# EAGLE design CS_EPS (EAGLE 9.5.0)
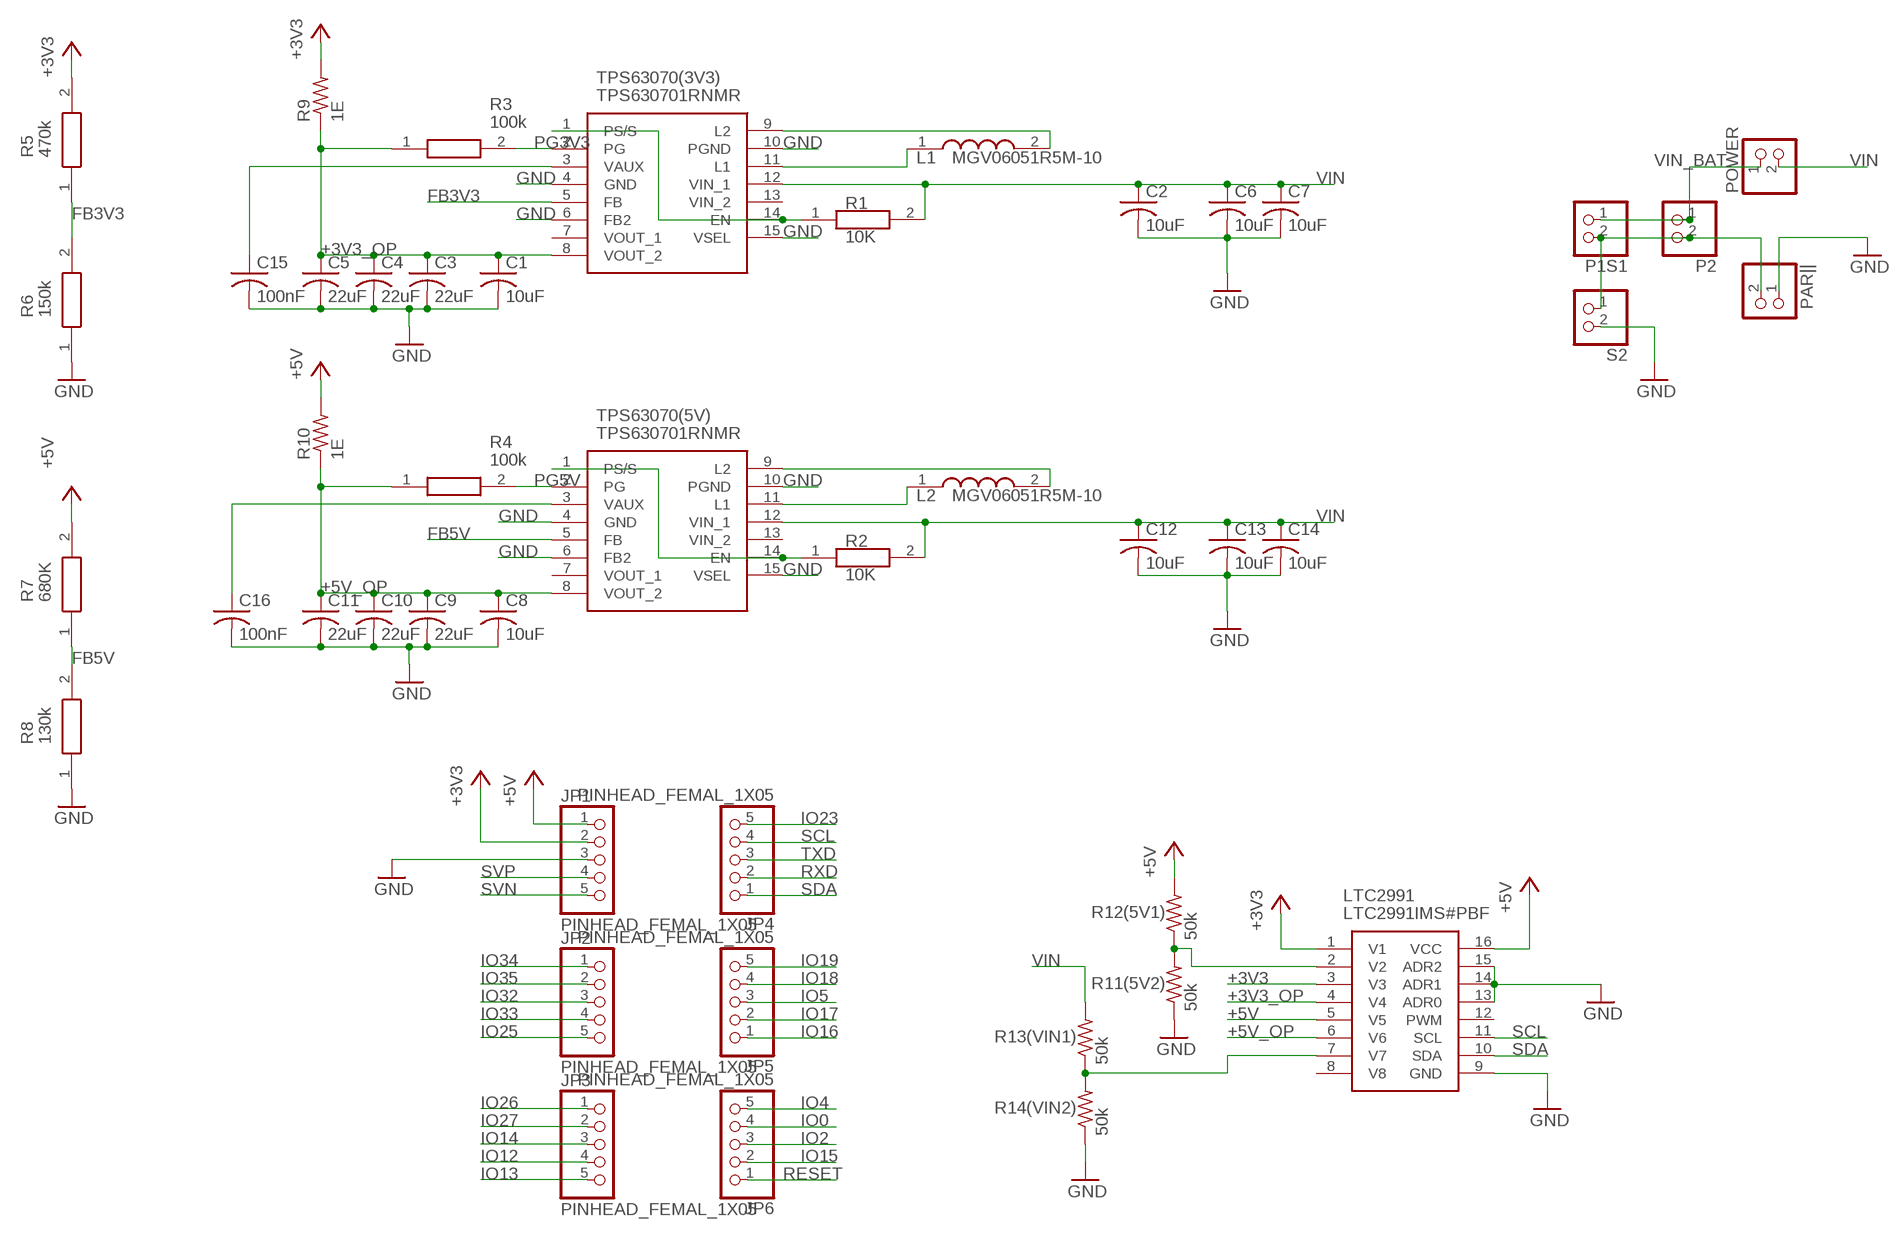
[diagram p0: schematic, sheet 1]

## Parts
C1  10uF  C-USC0603K  [C0603K]
C2  10uF  C-USC0603K  [C0603K]
C3  22uF  C-USC0805K  [C0805K]
C4  22uF  C-USC0805K  [C0805K]
C5  22uF  C-USC0805K  [C0805K]
C6  10uF  C-USC0805K  [C0805K]
C7  10uF  C-USC0805K  [C0805K]
C8  10uF  C-USC0603K  [C0603K]
C9  22uF  C-USC0805K  [C0805K]
C10  22uF  C-USC0805K  [C0805K]
C11  22uF  C-USC0805K  [C0805K]
C12  10uF  C-USC0603K  [C0603K]
C13  10uF  C-USC0805K  [C0805K]
C14  10uF  C-USC0805K  [C0805K]
C15  100nF  C-USC0402  [C0402]
C16  100nF  C-USC0402  [C0402]
JP1  PINHEAD_FEMAL_1X05  [1X05F]
JP2  PINHEAD_FEMAL_1X05  [1X05F]
JP3  PINHEAD_FEMAL_1X05  [1X05F]
JP4  PINHEAD_FEMAL_1X05  [1X05F]
JP5  PINHEAD_FEMAL_1X05  [1X05F]
JP6  PINHEAD_FEMAL_1X05  [1X05F]
L1  MGV06051R5M-10  [INDPM7367X530N]
L2  MGV06051R5M-10  [INDPM7367X530N]
LTC2991  LTC2991IMS#PBF  [SOP50P490X110-16N]
P1S1  JST_2PIN-THM  [JST-PH-2-THM]
P2  JST_2PIN-THM  [JST-PH-2-THM]
PAR||  PINHD-1X2  [1X02]
POWER  PINHD-1X2  [1X02]
R1  10K  ERA-6AED134V  [RESC2012X60N]
R2  10K  ERA-6AED134V  [RESC2012X60N]
R3  100k  ERA-6AED134V  [RESC2012X60N]
R4  100k  ERA-6AED134V  [RESC2012X60N]
R5  470k  ERA-6AED134V  [RESC2012X60N]
R6  150k  ERA-6AED134V  [RESC2012X60N]
R7  680K  ERA-6AED134V  [RESC2012X60N]
R8  130k  ERA-6AED134V  [RESC2012X60N]
R9  1E  R-US_R0805  [R0805]
R10  1E  R-US_R0805  [R0805]
R11(5V2)  50k  R-US_R0805  [R0805]
R12(5V1)  50k  R-US_R0805  [R0805]
R13(VIN1)  50k  R-US_R0805  [R0805]
R14(VIN2)  50k  R-US_R0805  [R0805]
S2  JST_2PIN-THM  [JST-PH-2-THM]
TPS63070(3V3)  TPS630701RNMR  [TPS630701RNMR]
TPS63070(5V)  TPS630701RNMR  [TPS630701RNMR]

## Nets
+3V3: JP1.2 LTC2991.1(V1) LTC2991.3(V3) R5.2 R9.2
+3V3_OP: C1.1 C3.1 C4.1 C5.1 LTC2991.4(V4) R3.1 R9.1 TPS63070(3V3).8(VOUT_2)
+5V: JP1.1 LTC2991.5(V5) LTC2991.16(VCC) R7.2 R10.2 R12(5V1).2
+5V_OP: C8.1 C9.1 C10.1 C11.1 LTC2991.6(V6) R4.1 R10.1 TPS63070(5V).8(VOUT_2)
FB3V3: R5.1 R6.2 TPS63070(3V3).5(FB)
FB5V: R7.1 R8.2 TPS63070(5V).5(FB)
GND: C1.2 C2.2 C3.2 C4.2 C5.2 C6.2 C7.2 C8.2 C9.2 C10.2 C11.2 C12.2 C13.2 C14.2 C15.2 C16.2 JP1.3 LTC2991.9(GND) LTC2991.13(ADR0) LTC2991.14(ADR1) LTC2991.15(ADR2) PAR||.1 R6.1 R8.1 R11(5V2).1 R14(VIN2).1 S2.2 TPS63070(3V3).4(GND) TPS63070(3V3).6(FB2) TPS63070(3V3).10(PGND) TPS63070(3V3).15(VSEL) TPS63070(5V).4(GND) TPS63070(5V).6(FB2) TPS63070(5V).10(PGND) TPS63070(5V).15(VSEL)
IO0: JP6.4
IO2: JP6.3
IO4: JP6.5
IO5: JP5.3
IO12: JP3.4
IO13: JP3.5
IO14: JP3.3
IO15: JP6.2
IO16: JP5.1
IO17: JP5.2
IO18: JP5.4
IO19: JP5.5
IO23: JP4.5
IO25: JP2.5
IO26: JP3.1
IO27: JP3.2
IO32: JP2.3
IO33: JP2.4
IO34: JP2.1
IO35: JP2.2
L11: L1.1 TPS63070(3V3).11(L1)
L12: L1.2 TPS63070(3V3).9(L2)
L21: L2.1 TPS63070(5V).11(L1)
L22: L2.2 TPS63070(5V).9(L2)
N$1: P1S1.2 P2.2 PAR||.2 S2.1
N$2: LTC2991.2(V2) R11(5V2).2 R12(5V1).1
N$3: R1.1 TPS63070(3V3).1(PS/S) TPS63070(3V3).14(EN)
N$4: LTC2991.7(V7) R13(VIN1).1 R14(VIN2).2
N$6: R2.1 TPS63070(5V).1(PS/S) TPS63070(5V).14(EN)
N$7: C15.1 TPS63070(3V3).3(VAUX)
N$8: C16.1 TPS63070(5V).3(VAUX)
PG3V3: R3.2 TPS63070(3V3).2(PG)
PG5V: R4.2 TPS63070(5V).2(PG)
RESET: JP6.1
RXD: JP4.2
SCL: JP4.4 LTC2991.11(SCL)
SDA: JP4.1 LTC2991.10(SDA)
SVN: JP1.5
SVP: JP1.4
TXD: JP4.3
VIN: C2.1 C6.1 C7.1 C12.1 C13.1 C14.1 POWER.2 R1.2 R2.2 R13(VIN1).2 TPS63070(3V3).12(VIN_1) TPS63070(5V).12(VIN_1)
VIN_BAT: P1S1.1 P2.1 POWER.1
Unconnected: LTC2991.8(V8) LTC2991.12(PWM) TPS63070(3V3).7(VOUT_1) TPS63070(3V3).13(VIN_2) TPS63070(5V).7(VOUT_1) TPS63070(5V).13(VIN_2)

## Library data of the parts
C1-C16 = rcl:C-US: CAPACITOR, American symbol; SPICEPREFIX: C
JP1-JP6 = SamacSys_3D:PINHEAD_FEMAL_1X05
L1 L2 = SamacSys_3D:MGV06051R5M-10: Fixed Inductors 1.5uH +/-20% Source: Datasheet <https://assets.lairdtech.com/home/brandworld/files/MGV06051R5M-10.pdf>; DESCRIPTION: Fixed Inductors 1.5uH +/-20%; HEIGHT: 5.3mm; MANUFACTURER_NAME: Laird Performance Materials; MANUFACTURER_PART_NUMBER: MGV06051R5M-10; MOUSER_PART_NUMBER: 875-MGV06051R5M-10; MOUSER_PRICE-STOCK: https://www.mouser.com/Search/Refine.aspx?Keyword=875-MGV06051R5M-10
LTC2991 = SamacSys_3D:LTC2991IMS#PBF: Current & Power Monitors & Regulators Octal I2C V, C, & Temp Mon Source: Datasheet <https://www.analog.com/media/en/technical-documentation/data-sheets/2991ff.pdf>; DESCRIPTION: Current & Power Monitors & Regulators Octal I2C V, C, & Temp Mon; HEIGHT: 1.1mm; MANUFACTURER_NAME: Analog Devices; MANUFACTURER_PART_NUMBER: LTC2991IMS#PBF; MOUSER_PART_NUMBER: 584-LTC2991IMS#PBF; MOUSER_PRICE-STOCK: https://www.mouser.com/Search/Refine.aspx?Keyword=584-LTC2991IMS%23PBF
P1S1 P2 S2 = adafruit:JST_2PIN: JST 2-Pin Connectors of various flavors SMT-RA (S2B-PH-SM4) 4UConnector #17311 SMT (B2B-PH-SM4) THM-RA (S2B-PH) THM (B2B-PH)
PAR|| POWER = pinhead:PINHD-1X2: PIN HEADER
R1-R8 = SamacSys_Parts:ERA-6AED134V: PANASONIC ELECTRONIC COMPONENTS - ERA-6AED134V - RES, THIN FILM, 130K, 0.5%, 0.125W, 0805 Source: Datasheet <https://industrial.panasonic.com/cdbs/www-data/pdf/RDA0000/AOA0000C237.pdf>; DESCRIPTION: PANASONIC ELECTRONIC COMPONENTS - ERA-6AED134V - RES, THIN FILM, 130K, 0.5%, 0.125W, 0805; HEIGHT: 0.6mm; MANUFACTURER_NAME: Panasonic; MANUFACTURER_PART_NUMBER: ERA-6AED134V; MOUSER_PART_NUMBER: 667-ERA-6AED134V; MOUSER_PRICE-STOCK: https://www.mouser.com/Search/Refine.aspx?Keyword=667-ERA-6AED134V
R9 R10 R11(5V2) R12(5V1) R13(VIN1) R14(VIN2) = rcl:R-US_: RESISTOR, American symbol; SPICEPREFIX: R
TPS63070(3V3) TPS63070(5V) = SamacSys_3D:TPS630701RNMR: Wide Input Voltage (2V-16V) Buck-Boost Converter Source: Datasheet <http://www.ti.com/lit/gpn/tps63070>; DESCRIPTION: Wide Input Voltage (2V-16V) Buck-Boost Converter; HEIGHT: mm; MANUFACTURER_NAME: Texas Instruments; MANUFACTURER_PART_NUMBER: TPS630701RNMR; MOUSER_PART_NUMBER: 595-TPS630701RNMR; MOUSER_PRICE-STOCK: https://www.mouser.com/Search/Refine.aspx?Keyword=595-TPS630701RNMR

## Board
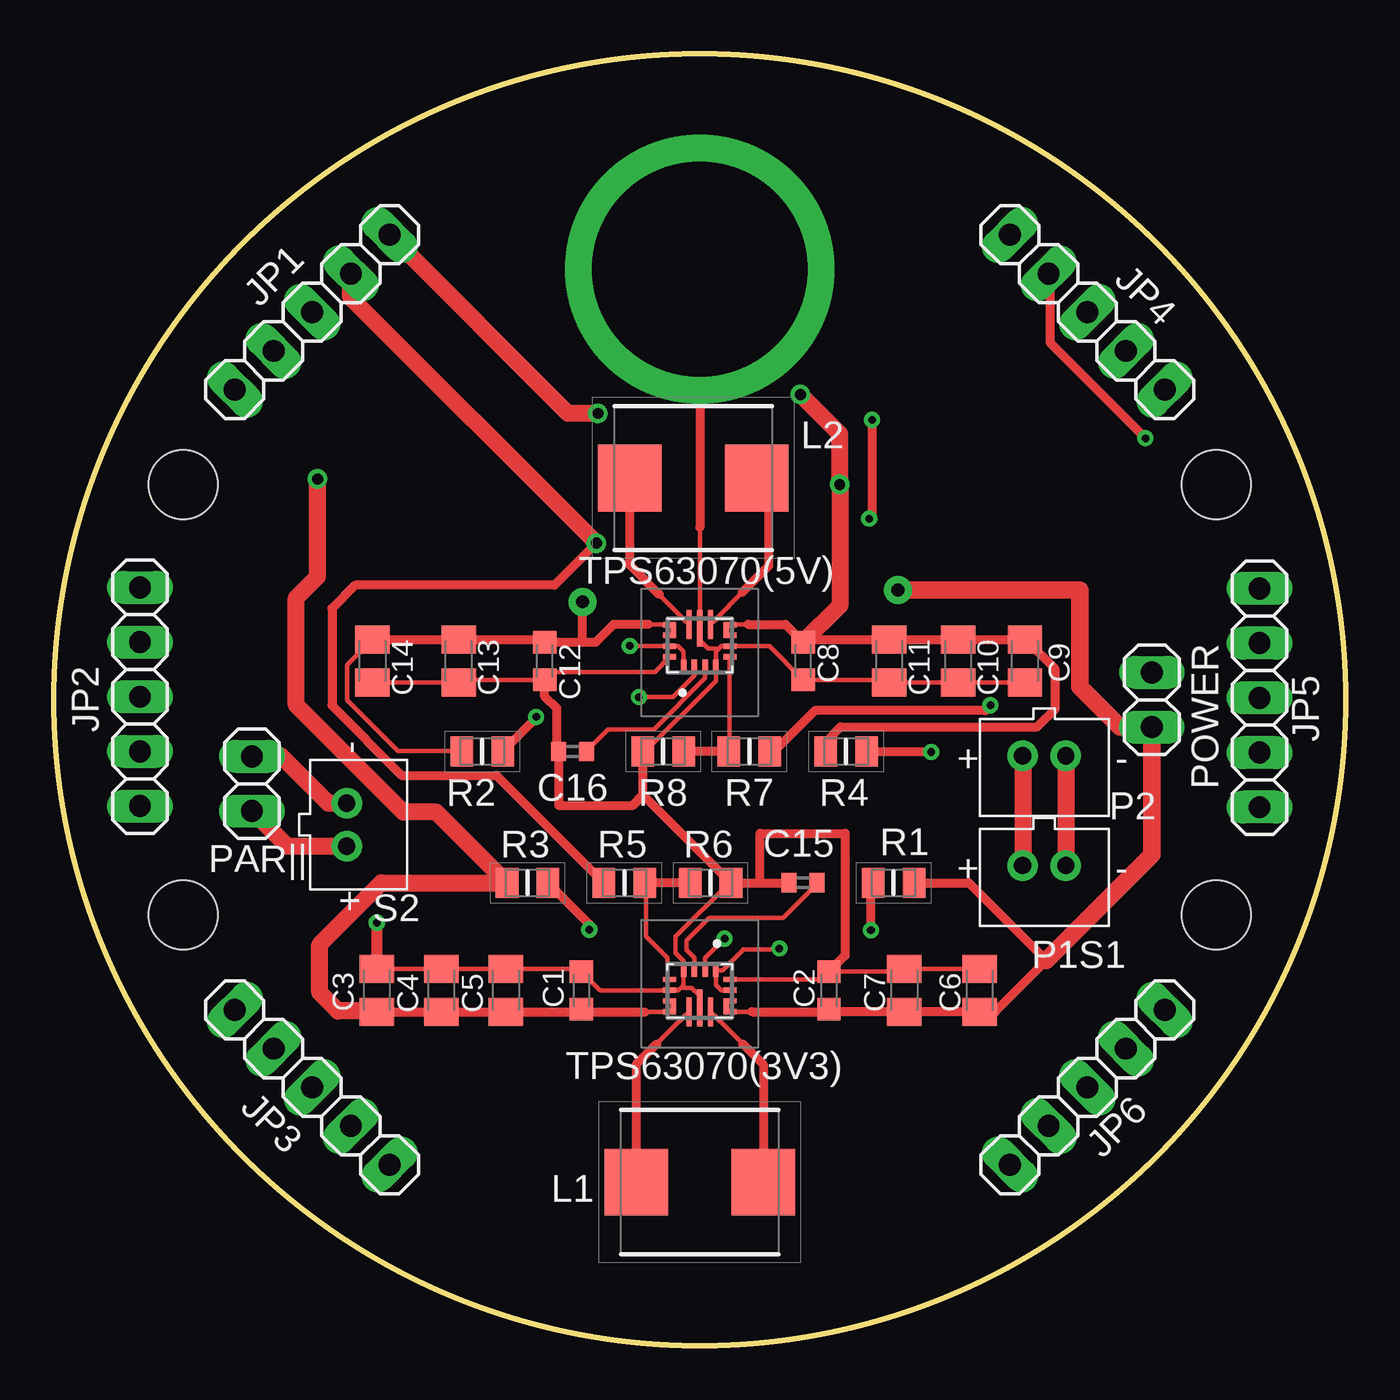
[diagram p1: board, top side]
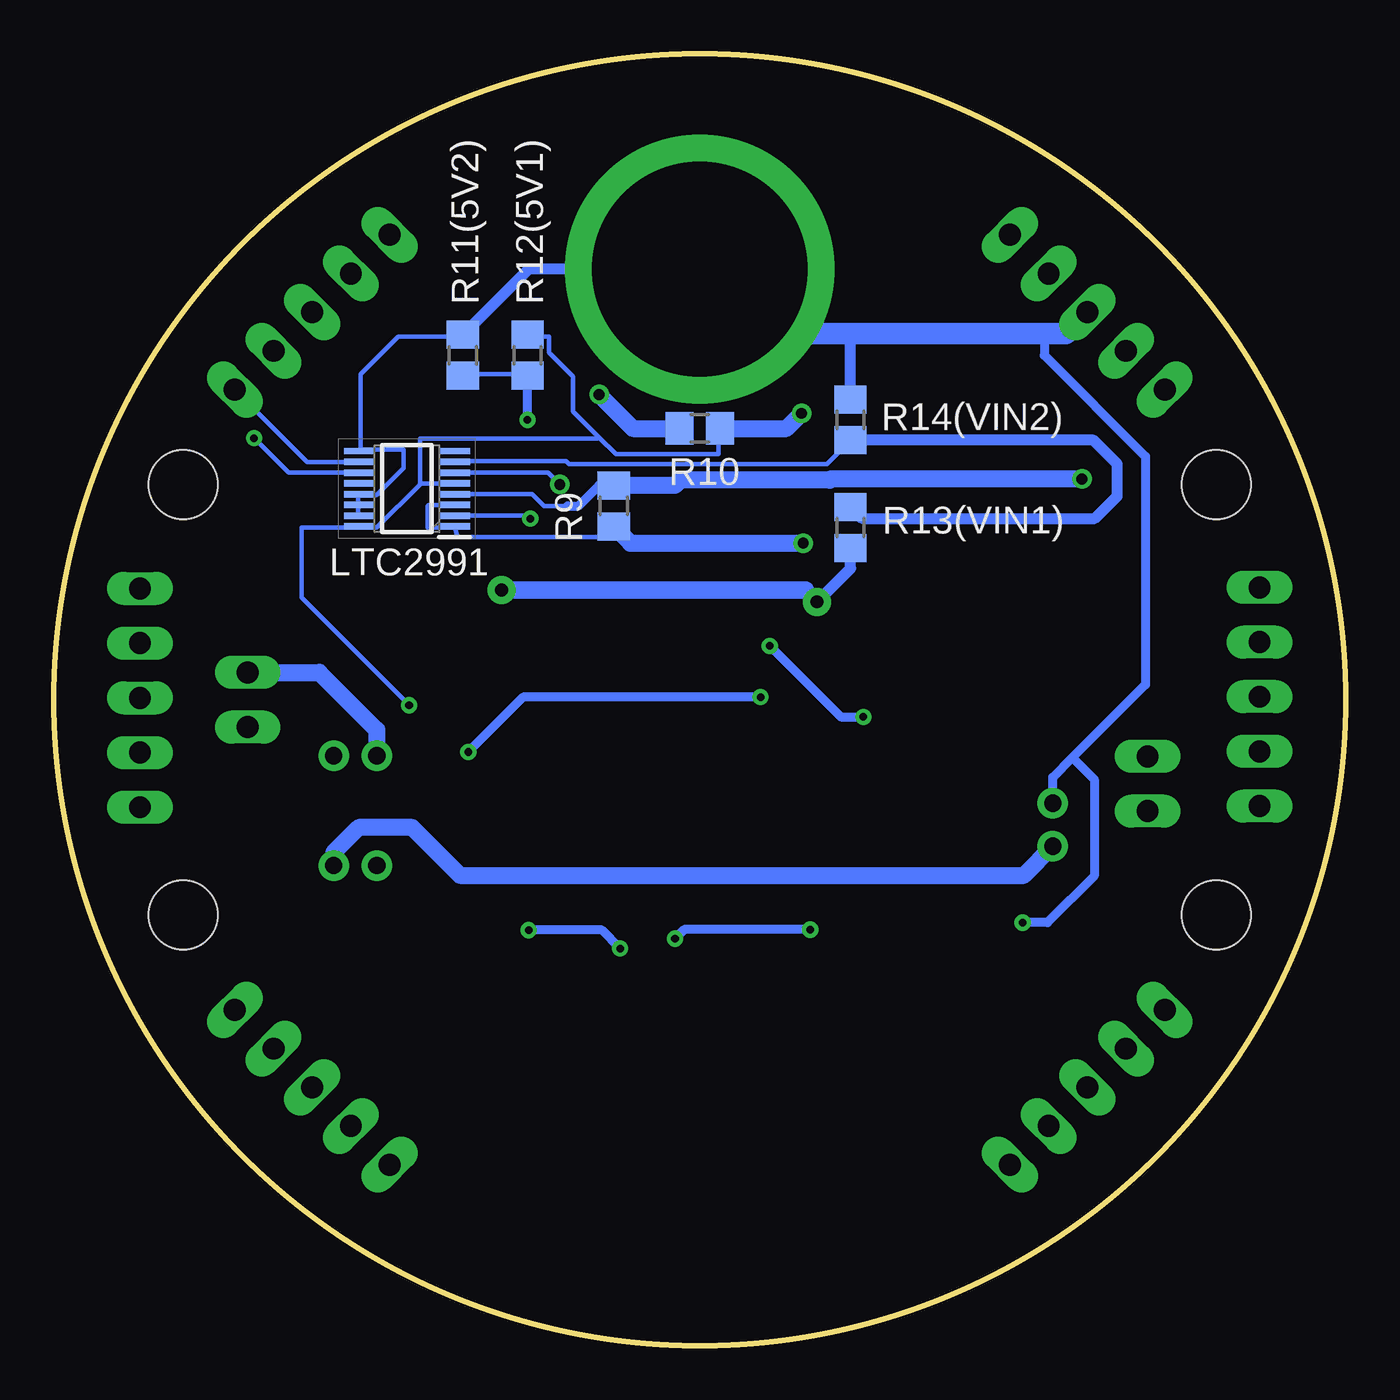
[diagram p2: board, bottom side, seen from below]

Size 60 x 60 mm. Coordinates in mm from the lower left corner, seen from the top.
Outline: circle at 30,30 radius 30
Copper layers (1*16): Top 0.035mm / dielectric 1.5mm / Bottom 0.035mm
Design rules "CanSat *": minimum track width 8mil, minimum drill 0.35mm, track to track 8mil, track to pad 8mil, pad to pad 6mil, via to via 15mil, smd to smd 6mil, copper to edge 1.5mm, drill to drill 10mil, minimum pad ring 10mil, minimum via ring 8mil, stop-mask expansion 6mil, vias tented up to drill 0mil, thermal gap 8mil
Holes 3.2 mm at 6,40 6,20 54,40 54,20
vRestrict: area 22,44 to 38,54

### Footprints (pad centres in the part's own frame; a part is rotated, then mirrored left to right if it is on the bottom)
C0603K = smd 1.05 x 1.08: 1 -0.875,0; 2 0.875,0
C0805K = smd 1.3 x 1.6: 1 -1,0; 2 1,0
C0402 = smd 0.7 x 0.9: 1 -0.65,0; 2 0.65,0
1X05F = drill 1.016 long: 1 -5.08,0; 2 -2.54,0; 3 0,0; 4 2.54,0; 5 5.08,0
INDPM7367X530N = smd 2.95 x 3.1: 1 -2.95,0; 2 2.95,0
SOP50P490X110-16N = smd 1.425 x 0.3: 1 -2.212,1.75; 2 -2.212,1.25; 3 -2.212,0.75; 4 -2.212,0.25; 5 -2.212,-0.25; 6 -2.212,-0.75; 7 -2.212,-1.25; 8 -2.212,-1.75; 9 2.212,-1.75; 10 2.212,-1.25; 11 2.212,-0.75; 12 2.212,-0.25; 13 2.212,0.25; 14 2.212,0.75; 15 2.212,1.25; 16 2.212,1.75
JST-PH-2-THM = drill 0.8 pad 1.422: 1 1,0; 2 -1,0
1X02 = drill 1.016 long: 1 -1.27,0; 2 1.27,0
RESC2012X60N = smd 1.05 x 1.4: 1 -0.95,0; 2 0.95,0
R0805 = smd 1.3 x 1.5: 1 -0.95,0; 2 0.95,0
TPS630701RNMR = smd 0.6 x 0.25: 1 -0.438,0.75; 2 -0.438,0.25; 3 -0.438,-0.25; 4 -0.438,-0.75 | smd 0.25 x 0.6: 5 -0.012,-1.4; 6 0.488,-1.4; 7 0.988,-1.4; 8 1.488,-1.4; 12 1.488,1.4; 13 0.988,1.4; 14 0.488,1.4; 15 -0.012,1.4 | smd 1.35 x 0.25: 9 1.488,-0.5; 11 1.488,0.5 | smd 1.7 x 0.25: 10 1.313,0 | smd 0.25 x 0.25: 16 1.238,1.225; 17 1.238,-1.225

### Placement (x,y rotation side)
C1  24.5,16.5 90 top
C2  36,16.5 90 top
C3  15,16.5 90 top
C4  18,16.5 90 top
C5  21,16.5 90 top
C6  43,16.5 90 top
C7  39.5,16.5 90 top
C8  34.8,31.8 270 top
C9  45.1,31.8 270 top
C10  42,31.8 270 top
C11  38.8,31.8 270 top
C12  22.8,31.8 270 top
C13  18.8,31.8 270 top
C14  14.8,31.8 270 top
C15  34.8,21.5 180 top
C16  24.1,27.6 180 top
JP1  12,48 225 top
JP2  4,30.14 270 top
JP3  12,12 315 top
JP4  48,48 135 top
JP5  56,30.09 90 top
JP6  48,12 45 top
L1  30,7.6 180 top
L2  29.7,40.3 0 top
LTC2991  43.6,39.8 180 bottom
P1S1  46,22.3 180 top
P2  46,27.4 180 top
PAR||  9.2,26.1 270 top
POWER  51,30 270 top
R1  39,21.5 0 top
R2  19.9,27.6 180 top
R3  22,21.5 0 top
R4  36.8,27.6 0 top
R5  26.5,21.5 180 top
R6  30.5,21.5 180 top
R7  32.3,27.6 0 top
R8  28.3,27.6 0 top
R9  34,39 270 bottom
R10  30,42.6 0 bottom
R11(5V2)  41,46 270 bottom
R12(5V1)  38,46 90 bottom
R13(VIN1)  23,38 270 bottom
R14(VIN2)  23,43 270 bottom
S2  13.61,24.2 270 top
TPS63070(3V3)  30,17 270 top
TPS63070(5V)  30,32 90 top

### Tracks (layer width: path | path; a pad name or v marks a point on that pad's centre or on a via)
+3V3  (via drill 0.5)
  Top 0.406: R5.2 20.56,26.49 16.16,26.49 12.92,29.74 12.92,34.24 14,35.33 23.25,35.33 v25.2,37.27
  Top 0.8: v25.2,37.27 13.8,48.68 JP1.2
  Bottom 0.203: R9.2 34.02,38.02 34.5,37.55 41.26,37.55 LTC2991.1 41.44,38 42.65,38 42.65,39 42.6,39.05 LTC2991.3
  Bottom 0.406: v25.2,37.27 33.27,37.27 34.02,38.02
  Bottom 0.8: R9.2 33.23,37.27 v25.2,37.27
+3V3_OP  (via drill 0.5)
  Top 0.203: TPS63070(3V3).8 27.46,15.51 27.45,15.5
  Top 0.406: C3.1 C4.1 C5.1 24.38,15.5 C1.1 24.62,15.5 | 24.62,15.5 25,15.5 | 25,15.5 27.45,15.5 | 25,15.5 24.62,15.5
  Top 0.8: v12.25,40.25 12.25,35.72 11.26,34.73 11.26,29.76 16.23,24.79 17.76,24.79 R3.1 15.21,21.5 12.35,18.64 12.35,16.4 13.2,15.55 14.95,15.55 C3.1
  Bottom 0.203: LTC2991.4 37.79,39.55 37.24,39 36.14,39
  Bottom 0.406: 36.14,39 35.64,39 34.69,39.95 R9.1
  Bottom 0.8: v12.25,40.25 23.9,40.25 23.96,40.2 30.91,40.2 31.15,39.95 R9.1
+5V  (via drill 0.35, 0.5)
  Top 0.203: 33.25,27.62 R7.2
  Top 0.406: v43.5,29.75 43.25,29.5 35.35,29.5 33.48,27.62 33.25,27.62
  Top 0.8: v25.27,43.3 23.88,43.3 JP1.1
  Bottom 0.203: v43.5,29.75 48.5,34.75 48.5,38 45.88,38 LTC2991.16 45.75,38 45,38 43,40 | 34.69,42.19 35.88,43.38 35.88,45 37,46.12 37,46.88 38,46.88 R12(5V1).2 | 34.69,42.19 33.9,41.4 29.12,41.4 29.12,42.6 R10.2 | 43,40 42.95,40.05 LTC2991.5 | 43,40 43,42.12 34.75,42.12 34.69,42.19
  Bottom 0.8: R10.2 25.98,42.6 v25.27,43.3
+5V_OP  (via drill 0.5)
  Top 0.203: 36.12,27.5 35.88,27.5 R4.1 | 45.12,32.75 C9.1 | TPS63070(5V).8 31.41,33.5 32.25,33.5
  Top 0.406: 45.12,32.75 45.08,32.8 C10.1 C11.1 34.92,32.8 C8.1 33.98,33.5 32.25,33.5 | R4.1 35.85,28.05 36.54,28.74 45.66,28.74 46.51,29.58 46.51,31.42 45.12,32.8 C9.1
  Top 0.8: C8.1 36.5,34.38 v36.5,40 36.5,42.35 v34.67,44.17
  Bottom 0.203: LTC2991.6 41.38,40.54 37.04,40.54 v36.5,40
  Bottom 0.8: v34.67,44.17 33.1,42.6 R10.1
FB3V3
  Top 0.203: 27.5,21.5 27.5,19 28.5,18 28.5,17.12 TPS63070(3V3).5 | 27.65,21.5 27.5,21.5 | 27.5,21.5 R5.1
  Top 0.406: R6.2 27.65,21.5
FB5V
  Top 0.203: TPS63070(5V).5 31.38,31.88 31.38,27.62 R7.1 31.25,27.62
  Top 0.406: R8.2 29.27,27.62 31.25,27.62
GND  (via drill 0.35, 10 pad 12.5)
  Top 0.203: C14.2 C13.2 18.93,30.93 C12.2 23.18,31.3 23.5,31.3 27.91,31.3 TPS63070(5V).15 | C9.2 C10.2 C11.2 38.67,30.93 C8.2 33.24,32.49 TPS63070(5V).6 31.38,32.5 31,32.5 30.81,32.31 | C3.2 C4.2 C5.2 24.38,17.5 C1.2 25.36,16.51 TPS63070(3V3).6 28.62,16.5 29,16.5 29.19,16.69 | TPS63070(3V3).15 35.64,17.01 35.94,17.31 C2.2 | C2.2 36.12,17.38 | 36.12,17.38 39.38,17.38 C7.2 C6.2 | 30.81,32.31 30.75,32.25 TPS63070(5V).4 30.75,30.88 27.38,27.5 R8.1 | 30.81,32.31 30.75,32.38 30.38,32.38 30,32.75 TPS63070(5V).10 30,38 | 29.19,16.69 29.25,16.75 TPS63070(3V3).4 29.25,17.88 28.88,18.25 28.88,19 31.38,21.5 R6.1 | TPS63070(3V3).10 30,16.25 29.62,16.62 29.25,16.62 29.19,16.69 | 23.5,27.62 C16.2 | 36.12,17.38 C2.2
  Top 0.406: v30,50 30,38 | 27.38,25.57 R6.1 32.8,21.5 | 27.38,25.57 27.38,27.5 | 32.8,21.5 C15.2 | 27.38,25.57 26.9,25.1 23.45,25.1 C16.2 23.36,27.69 23.36,29.6 22.8,30.16 C12.2 | 32.8,21.5 32.8,23.8 36.75,23.8 36.75,18.12 35.94,17.31
  Top 0.5: v15,19.65 C3.2
  Top 0.8: PAR||.1 10.57,27.37 11.5,26.44 | S2.2 12.75,25.2 11.5,26.44 | 11.5,26.44
  Bottom 0.203: LTC2991.15 45.88,38.62 45.88,39 LTC2991.14 45.88,39.12 45.88,39.5 LTC2991.13 45.75,39.5 45,39.5 43.75,40.75 43.75,41.62 45.75,41.62 | R11(5V2).1 41,46.88 44,46.88 45.75,45.12 45.75,41.62 | 45.75,41.62 LTC2991.9
  Bottom 0.406: 14,47 14,46 9.3,41.3 9.3,30.7 12.68,27.32 12.69,27.32 | S2.2 13.61,26.4 12.69,27.32 | v15,19.65 13.85,19.65 11.68,21.82 11.68,26.3 12.69,27.32
  Bottom 0.5: v30,50 37.95,50 R11(5V2).1 | R14(VIN2).1 23,47
  Bottom 1: JP1.3 13,47 13.25,47 14,47 23,47 27,47 v30,50
L11
  Top 0.203: TPS63070(3V3).11 30.74,15.27 30.74,15.24 30.95,15.03 30.98,15.03 32.01,14.01
  Top 0.406: 32.01,14.01 32.95,13.06 L1.1
L12
  Top 0.203: 27.05,8 L1.2 | TPS63070(3V3).9 29.26,15.27 29.26,15.24 29.05,15.03 29.02,15.03 27.99,14.01
  Top 0.406: 27.99,14.01 27.05,13.06 27.05,8
L21
  Top 0.203: 26.75,39 L2.1 | TPS63070(5V).11 29.26,33.73 29.26,33.76 28.12,34.9
  Top 0.406: 28.12,34.9 26.75,36.27 26.75,39
L22
  Top 0.203: TPS63070(5V).9 30.74,33.73 30.74,33.76 31.96,34.98
  Top 0.406: 31.96,34.98 33.2,36.22 33.2,39.75 L2.2
N$1
  Top 0.8: P2.2 P1S1.2 | PAR||.2 10.83,23.2 S2.1
  Bottom 0.8: S2.1 14.96,21.85 41.14,21.85 43.36,24.06 45.84,24.06 47,22.9 P1S1.2
N$2  (via drill 0.35)
  Top 0.406: v38,43 38,38.55 v37.87,38.41
  Bottom 0.203: R12(5V1).1 38,45.12 41,45.12 R11(5V2).2 | LTC2991.2 38.01,38.55 v37.87,38.41
  Bottom 0.406: v38,43 R12(5V1).1
N$3  (via drill 0.35)
  Top 0.203: TPS63070(3V3).14 31.38,16.5 31,16.5 30.75,16.75 TPS63070(3V3).1 31.05,17.44 32,18.39 32,18.4 33.65,18.4 v33.7,18.45 | 38.02,21.48 R1.1
  Top 0.406: v37.95,19.3 37.95,21.4 38.02,21.48
  Bottom 0.406: v33.7,18.45 34.55,19.3 v37.95,19.3
N$4
  Bottom 0.203: 22.6,42.05 R14(VIN2).2 24.1,40.95 36.08,40.95 36.2,41.08 41.36,41.08 LTC2991.7
  Bottom 0.5: R13(VIN1).1 22.47,38.42 11.65,38.42 10.62,39.45 10.62,40.95 11.72,42.05 22.6,42.05
N$6  (via drill 0.35)
  Top 0.203: TPS63070(5V).1 29.25,32.25 29,32.5 28.62,32.5 TPS63070(5V).14 28.5,32.5 v26.75,32.5
  Top 0.406: v22.4,29.2 22.4,29.15 R2.1
  Bottom 0.406: v26.75,32.5 23.45,29.2 v22.4,29.2
N$7
  Top 0.203: TPS63070(3V3).3 29.75,18 29.38,18.38 29.38,18.82 30.43,19.88 33.88,19.88 35.5,21.5 C15.1
N$8
  Top 0.203: TPS63070(5V).3 30.25,31 27.88,28.62 25.75,28.62 24.75,27.62 C16.1
PG3V3  (via drill 0.35)
  Top 0.203: TPS63070(3V3).2 30.25,18 v31.15,18.9
  Top 0.406: v24.88,19.32 24.88,19.57 R3.2
  Bottom 0.406: v24.88,19.32 30.73,19.32 v31.15,18.9
PG5V  (via drill 0.35)
  Top 0.203: TPS63070(5V).2 29.75,31.12 28.75,30.12 v27.18,30.12
  Top 0.406: v40.75,27.57 40.73,27.6 R4.2
  Bottom 0.406: v27.18,30.12 38.2,30.12 v40.75,27.57
SCL  (via drill 0.35)
  Top 0.406: JP4.4 46.29,49.71 46.29,46.56 v50.7,42.15
  Bottom 0.203: LTC2991.11 49.1,40.55 v50.7,42.15
SDA
  Bottom 0.203: LTC2991.10 48.23,41.05 JP4.1
VIN  (via drill 0.6 pad 1.3)
  Top 0.203: C14.1 13.62,31.62 13.62,30 16,27.62 18.88,27.62 R2.2 | 43.62,15.5 C6.1 | 32.42,15.51 TPS63070(3V3).12 | TPS63070(5V).12 27.61,33.49 27.6,33.5
  Top 0.406: 43.62,15.5 43.72,15.5 46.11,17.89 42.5,21.5 R1.2 | C6.1 C7.1 36.12,15.5 C2.1 35.88,15.51 32.42,15.51 | 24.55,32.67 v24.55,34.55 | C14.1 C13.1 22.68,32.8 C12.1 24.55,32.67 | 24.55,32.67 25.18,32.67 26,33.5 27.6,33.5
  Top 0.813: v39.2,35.1 47.65,35.1 47.65,30.6 49.52,28.73 POWER.2 51,22.78 46.11,17.89
  Bottom 0.406: 25.1,35.1 v24.55,34.55
  Bottom 0.5: v24.55,34.55 23,36.1 R13(VIN1).2
  Bottom 0.813: v39.2,35.1 25.1,35.1
VIN_BAT
  Top 0.8: P2.1 P1S1.1
  Bottom 0.8: POWER.1 47.67,31.27 45,28.6 P2.1